# EAGLE design Recording (EAGLE 8.5.0)
AUTHOR: Jared Wolff; BOARD_NUMBER: BRD-0001; COMPANY: Circuit Dojo; DOC_NUMBER: SCH-0001; DOC_REV: 1

## Sheet 1 of 2
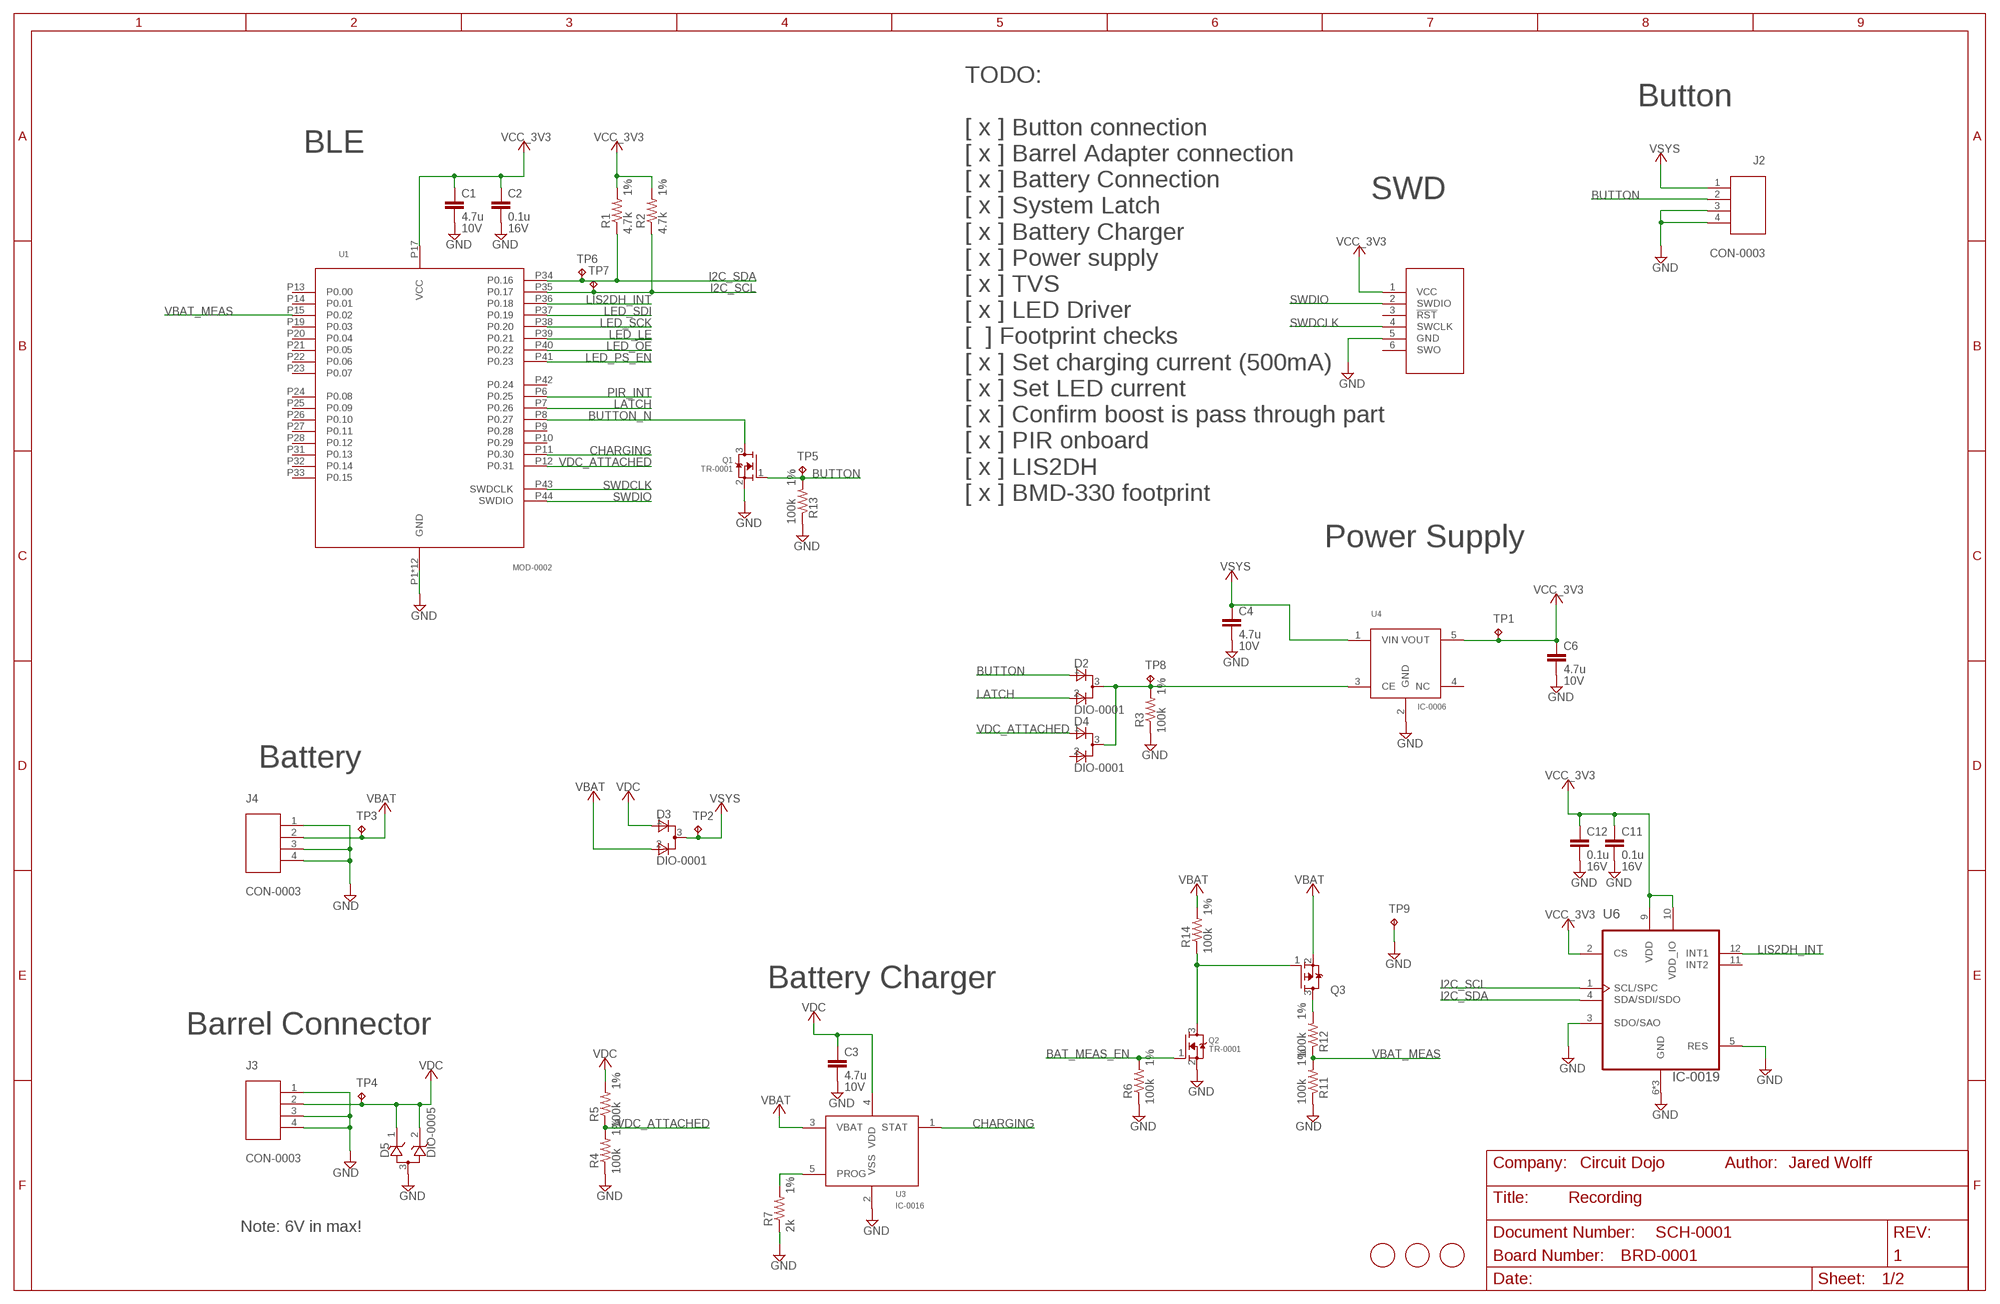
[diagram p0: schematic, sheet 1]

### Parts
C1  4.7u  CAP-0010  [C0603]
C2  0.1u  CAP-0004-SAM  [C0603]
C3  4.7u  CAP-0010  [C0603]
C4  4.7u  CAP-0010  [C0603]
C6  4.7u  CAP-0010  [C0603]
C11  0.1u  CAP-0004-SAM  [C0603]
C12  0.1u  CAP-0004-SAM  [C0603]
D2  DIO-0001  [SOT23]
D3  DIO-0001  [SOT23]
D4  DIO-0001  [SOT23]
D5  DIO-0005  [SOT23]
J1  CON-0002  [TC2030-MCP-NL]
J2  CON-0003  [CON-SM02B-SRSS-TB(LF)(SN)]
J3  CON-0003  [CON-SM02B-SRSS-TB(LF)(SN)]
J4  CON-0003  [CON-SM02B-SRSS-TB(LF)(SN)]
Q1  TR-0001  [SOT23]
Q2  TR-0001  [SOT23]
Q3  TR-0003  [SOT23]
R1  4.7k  RES-0028  [R0603]
R2  4.7k  RES-0028  [R0603]
R3  100k  RES-0001-PAN  [R0603]
R4  100k  RES-0001-PAN  [R0603]
R5  100k  RES-0001-PAN  [R0603]
R6  100k  RES-0001-PAN  [R0603]
R7  2k  RES-0030  [R0603]
R11  100k  RES-0001-PAN  [R0603]
R12  100k  RES-0001-PAN  [R0603]
R13  100k  RES-0001-PAN  [R0603]
R14  100k  RES-0001-PAN  [R0603]
TP1  TP-0001  [TP-1P27]
TP2  TP-0001  [TP-1P27]
TP3  TP-0001  [TP-1P27]
TP4  TP-0001  [TP-1P27]
TP5  TP-0001  [TP-1P27]
TP6  TP-0001  [TP-1P27]
TP7  TP-0001  [TP-1P27]
TP8  TP-0001  [TP-1P27]
TP9  TP-0001  [TP-1P27]
U1  MOD-0002  [MODULE-BMD-300]
U3  IC-0016  [SOT23-5]
U4  IC-0006  [SOT23-5]
U6  IC-0019  [PQFN50P200X200100-12N]
U$1  FIDUCIAL  [FIDUCIAL_1MM]
U$2  FIDUCIAL  [FIDUCIAL_1MM]
U$3  FIDUCIAL  [FIDUCIAL_1MM]

### Nets
BAT_MEAS_EN: Q2.1(G) R6.2
BAT_MEAS_P_GATE: Q2.3(D) Q3.1(G) R14.1
BUTTON: D2.1(A1) J2.2 Q1.1(G) R13.2 TP5.P$1(TP) TP5.P$2(TP) TP5.TP
BUTTON_N: Q1.3(D) U1.P8(P0.27)
CHARGER_PROG: R7.2 U3.5(PROG)
CHARGING: U1.P11(P0.30) U3.1(STAT)
GND: C1.2 C2.2 C3.2 C4.2 C6.2 C11.2 C12.2 D5.3(A) J1.5(GND) J2.3 J2.4 J3.1 J3.3 J3.4 J4.1 J4.3 J4.4 Q1.2(S) Q2.2(S) R3.1 R4.1 R6.1 R7.1 R11.1 R13.1 TP9.P$1(TP) TP9.P$2(TP) TP9.TP U1.P1(GND) U1.P2(GND) U1.P3(GND) U1.P4(GND) U1.P5(GND) U1.P16(GND) U1.P18(GND) U1.P29(GND) U1.P30(GND) U1.P45(GND) U1.P46(GND) U1.P47(GND) U3.2(VSS) U4.2(GND) U6.3(SDO/SAO) U6.5(RES) U6.6(GND) U6.7(GND) U6.8(GND) ; also sheet 2
I2C_SCL: R2.1 TP7.P$1(TP) TP7.P$2(TP) TP7.TP U1.P35(P0.17) U6.1(SCL/SPC)
I2C_SDA: R1.1 TP6.P$1(TP) TP6.P$2(TP) TP6.TP U1.P34(P0.16) U6.4(SDA/SDI/SDO)
LATCH: D2.2(A2) U1.P7(P0.26)
LED_!OE: U1.P40(P0.22) ; also sheet 2
LED_LE: U1.P39(P0.21) ; also sheet 2
LED_PS_EN: U1.P41(P0.23) ; also sheet 2
LED_SCK: U1.P38(P0.20) ; also sheet 2
LED_SDI: U1.P37(P0.19) ; also sheet 2
LIS2DH_INT: U1.P36(P0.18) U6.12(INT1)
N$3: J2.1
PIR_INT: U1.P6(P0.25) ; also sheet 2
SWDCLK: J1.4(SWCLK) U1.P43(SWDCLK)
SWDIO: J1.2(SWDIO) U1.P44(SWDIO)
VBAT: D3.2(A2) J4.2 Q3.2(S) R14.2 TP3.P$1(TP) TP3.P$2(TP) TP3.TP U3.3(VBAT)
VBAT_MEAS: R11.2 R12.1 U1.P15(P0.02)
VBAT_SW: Q3.3(D) R12.2
VCC_3V3: C1.1 C2.1 C6.1 C11.1 C12.1 J1.1(VCC) R1.2 R2.2 TP1.P$1(TP) TP1.P$2(TP) TP1.TP U1.P17(VCC) U4.5(VOUT) U6.2(CS) U6.9(VDD) U6.10(VDD_IO) ; also sheet 2
VCC_3V3_EN: D2.3(C) D4.3(C) R3.2 TP8.P$1(TP) TP8.P$2(TP) TP8.TP U4.3(CE)
VDC: C3.1 D3.1(A1) D5.1(C1) D5.2(C2) J3.2 R5.2 TP4.P$1(TP) TP4.P$2(TP) TP4.TP U3.4(VDD)
VDC_ATTACHED: D4.1(A1) R4.2 R5.1 U1.P12(P0.31)
VSYS: C4.1 D3.3(C) TP2.P$1(TP) TP2.P$2(TP) TP2.TP U4.1(VIN) ; also sheet 2
Unconnected: D4.2(A2) J1.3(!RST) J1.6(SWO) U1.P9(P0.28) U1.P10(P0.29) U1.P13(P0.00) U1.P14(P0.01) U1.P19(P0.03) U1.P20(P0.04) U1.P21(P0.05) U1.P22(P0.06) U1.P23(P0.07) U1.P24(P0.08) U1.P25(P0.09) U1.P26(P0.10) U1.P27(P0.11) U1.P28(P0.12) U1.P31(P0.13) U1.P32(P0.14) U1.P33(P0.15) U1.P42(P0.24) U4.4(NC) U6.11(INT2)

### Notes on the sheet
- Button
- BLE
- SWD
- TODO:
  
  [ x ] Button connection
  [ x ] Barrel Adapter connection
  [ x ] Battery Connection
  [ x ] System Latch
  [ x ] Battery Charger
  [ x ] Power supply
  [ x ] TVS
  [ x ] LED Driver
  [  ] Footprint checks
  [ x ] Set charging current (500mA)
  [ x ] Set LED current
  [ x ] Confirm boost is pass through part
  [ x ] PIR onboard
  [ x ] LIS2DH
  [ x ] BMD-330 footprint
- Power Supply
- Battery
- Battery Charger
- Barrel Connector
- Note: 6V in max!

## Sheet 2 of 2
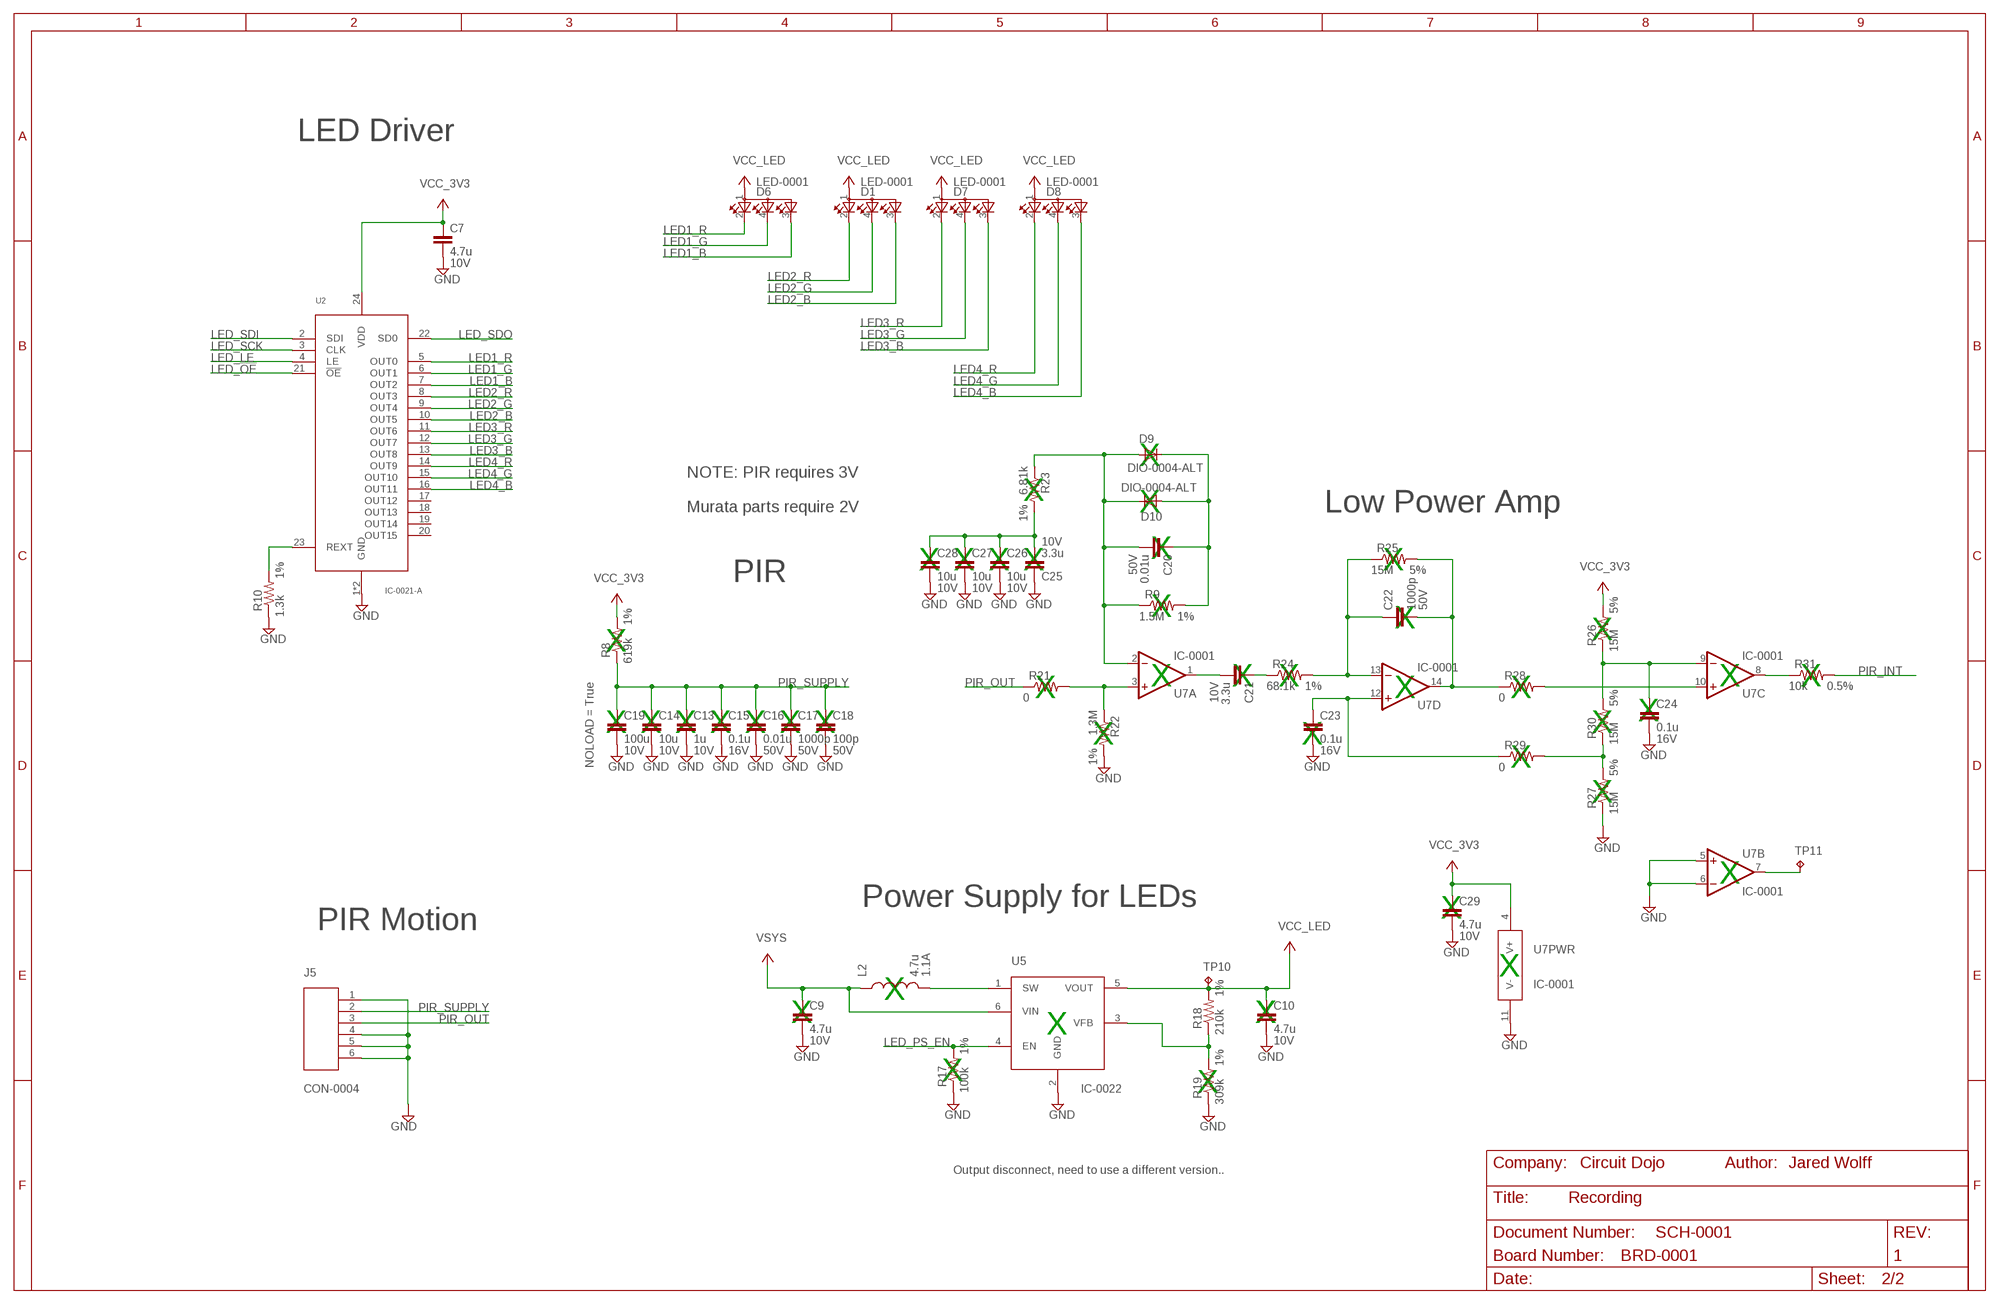
[diagram p1: schematic, sheet 2]

### Parts
C7  4.7u  CAP-0010  [C0603]
C9  4.7u  CAP-0010  [C0603]
C10  4.7u  CAP-0010  [C0603]
C13  1u  CAP-0003-SAM  [C0603]
C14  10u  CAP-0001-YAGEO  [C0805]
C15  0.1u  CAP-0004-SAM  [C0603]
C16  0.01u  CAP-0005  [C0603]
C17  1000p  CAP-0006  [C0603]
C18  100p  CAP-0007-ALT  [C0603]
C19  100u  CAP-0008  [C1210]
C20  0.01u  CAP-0005  [C0603]
C21  3.3u  CAP-0009  [C0603]
C22  1000p  CAP-0006  [C0603]
C23  0.1u  CAP-0004-SAM  [C0603]
C24  0.1u  CAP-0004-SAM  [C0603]
C25  3.3u  CAP-0009  [C0603]
C26  10u  CAP-0001-YAGEO  [C0805]
C27  10u  CAP-0001-YAGEO  [C0805]
C28  10u  CAP-0001-YAGEO  [C0805]
C29  4.7u  CAP-0010  [C0603]
D1  LED-0001  [LED_ASMB-KTF0-0A306]
D6  LED-0001  [LED_ASMB-KTF0-0A306]
D7  LED-0001  [LED_ASMB-KTF0-0A306]
D8  LED-0001  [LED_ASMB-KTF0-0A306]
D9  DIO-0004-ALT  [SOD523]
D10  DIO-0004-ALT  [SOD523]
J5  CON-0004  [CON-SM04B-SRSS-TB(LF)(SN)]
L2  4.7u  IND-0003  [IND-2P0X2P0X1P2]
R8  619k  RES-0018  [R0603]
R9  1.5M  RES-0009  [R0603]
R10  1.3k  RES-0031  [R0603]
R17  100k  RES-0001-PAN  [R0603]
R18  210k  RES-0032  [R0603]
R19  309k  RES-0015-PAN  [R0603]
R21  0  RES-0008  [R0603]
R22  1.3M  RES-0010  [R0603]
R23  6.81k  RES-0014-PAN  [R0603]
R24  68.1k  RES-0013-PAN  [R0603]
R25  15M  RES-0011  [R0603]
R26  15M  RES-0011  [R0603]
R27  15M  RES-0011  [R0603]
R28  0  RES-0008  [R0603]
R29  0  RES-0008  [R0603]
R30  15M  RES-0011  [R0603]
R31  10k  RES-0012-YAGEO  [R0603]
TP10  TP-0001  [TP-1P27]
TP11  TP-0001  [TP-1P27]
U2  IC-0021-A  [SOP65P640X120-25N]
U5  IC-0022  [SOT23-6]
U7  IC-0001  [TSSOP14]

### Nets
BOOST_FB: R18.1 R19.2 U5.3(VFB)
BOOST_SW: L2.P$2 U5.1(SW)
GND: C7.2 C9.2 C10.2 C13.2 C14.2 C15.2 C16.2 C17.2 C18.2 C19.2 C23.2 C24.2 C25.1 C26.2 C27.2 C28.2 C29.2 J5.1 J5.4 J5.5 J5.6 R10.1 R17.1 R19.1 R22.2 R27.1 U2.1(GND) U2.25(GND) U5.2(GND) U7.5(B:+IN) U7.6(B:-IN) U7.11(PWR:V-) ; also sheet 1
LED1_B: D6.3(CGREEN) U2.7(OUT2)
LED1_G: D6.4(CBLUE) U2.6(OUT1)
LED1_R: D6.2(CRED) U2.5(OUT0)
LED2_B: D1.3(CGREEN) U2.10(OUT5)
LED2_G: D1.4(CBLUE) U2.9(OUT4)
LED2_R: D1.2(CRED) U2.8(OUT3)
LED3_B: D7.3(CGREEN) U2.13(OUT8)
LED3_G: D7.4(CBLUE) U2.12(OUT7)
LED3_R: D7.2(CRED) U2.11(OUT6)
LED4_B: D8.3(CGREEN) U2.16(OUT11)
LED4_G: D8.4(CBLUE) U2.15(OUT10)
LED4_R: D8.2(CRED) U2.14(OUT9)
LED_!OE: U2.21(!OE) ; also sheet 1
LED_LE: U2.4(LE) ; also sheet 1
LED_PS_EN: R17.2 U5.4(EN) ; also sheet 1
LED_REXT: R10.2 U2.23(REXT)
LED_SCK: U2.3(CLK) ; also sheet 1
LED_SDI: U2.2(SDI) ; also sheet 1
LED_SDO: U2.22(SD0)
N$4: C20.2 D9.A D10.C R9.1 R23.1 U7.2(A:-IN)
N$5: TP11.P$1(TP) TP11.P$2(TP) TP11.TP U7.7(B:OUT)
N$6: C20.1 D9.C D10.A R9.2
N$8: R21.2 R22.1 U7.3(A:+IN)
N$11: C25.2 C26.1 C27.1 C28.1 R23.2
N$13: C21.2 U7.1(A:OUT)
N$14: C21.1 R24.1
N$15: C22.1 R24.2 R25.1 U7.13(D:-IN)
N$16: C22.2 R25.2 R28.1 U7.14(D:OUT)
N$17: C23.1 R29.1 U7.12(D:+IN)
N$18: R28.2 U7.10(C:+IN)
N$19: R27.2 R29.2 R30.1
N$20: C24.1 R26.1 R30.2 U7.9(C:-IN)
PIR_INT: R31.2 ; also sheet 1
PIR_INT_CL: R31.1 U7.8(C:OUT)
PIR_OUT: J5.3 R21.1
PIR_SUPPLY: C13.1 C14.1 C15.1 C16.1 C17.1 C18.1 C19.1 J5.2 R8.1
VCC_3V3: C7.1 C29.1 R8.2 R26.2 U2.24(VDD) U7.4(PWR:V+) ; also sheet 1
VCC_LED: C10.1 D1.1(A2) D6.1(A2) D7.1(A2) D8.1(A2) R18.2 TP10.P$1(TP) TP10.P$2(TP) TP10.TP U5.5(VOUT)
VSYS: C9.1 L2.P$1 U5.6(VIN) ; also sheet 1
Unconnected: U2.17(OUT12) U2.18(OUT13) U2.19(OUT14) U2.20(OUT15)

### Notes on the sheet
- LED Driver
- X
- X
- NOTE: PIR requires 3V
  
  Murata parts require 2V
- X | Low Power Amp
- X
- X | X | X | X | X
- PIR
- X
- X
- X
- X
- X | X | X | X | X
- X | X | X
- X
- X | X | X | X | X | X | X | X
- X | X
- X
- X
- X
- Power Supply for LEDs
- X
- PIR Motion
- X
- X
- X | X | X
- X
- X
- X
- Output disconnect, need to use a different version..

## Library data of the parts
C1 C3 C4 C6 C7 C9 C10 C29 = wolff-den:CAP-0010: CAP CER 4.7UF 10V X5R 0603; DIGIKEYPN: 1276-6684-1-ND; MPN: CL10A475MP5LNNC; TEMPHIGH: 85; TEMPLOW: -55; VOLTHIGH: 10V
C2 C11 C12 C15 C23 C24 = wolff-den:CAP-0004: CAP CER 0.1UF 16V X7R 0603; DIGIKEYPN: 1276-1005-1-ND; MPN: CL10B104KO8NNNC; TEMPHIGH: 125; TEMPLOW: -55; VOLTHIGH: 16V
C13 = wolff-den:CAP-0003: CAP CER 1UF 10V X5R 0603; DIGIKEYPN: 1276-1182-1-ND; MPN: CL10A105KP8NNNC; TEMPHIGH: 85; TEMPLOW: -55; VOLTHIGH: 10V
C14 C26-C28 = wolff-den:CAP-0001: CAP CER 10UF 10V X5R 0805; DIGIKEYPN: 587-1300-1-ND; MPN: LMK212BJ106KG-T; TEMPHIGH: 85; TEMPLOW: -55; VOLTHIGH: 10V
C16 C20 = wolff-den:CAP-0005: CAP CER 10000PF 50V X7R 0603; DIGIKEYPN: 1276-1921-1-ND; MPN: CL10B103KB8NCNC; TEMPHIGH: 125; TEMPLOW: -55; VOLTHIGH: 50V
C17 C22 = wolff-den:CAP-0006: CAP CER 1000PF 50V X7R 0603; DIGIKEYPN: 1276-1916-1-ND; MPN: CL10B102KB8SFNC; TEMPHIGH: 125; TEMPLOW: -55; VOLTHIGH: 50V
C18 = wolff-den:CAP-0007: CAP CER 100PF 50V C0G/NP0 0603; DIGIKEYPN: 1276-2161-1-ND; MPN: CL10C101GB8NNNC; TEMPHIGH: 125; TEMPLOW: -55; VOLTHIGH: 50V
C19 = wolff-den:CAP-0008: CAP CER 100UF 10V X5R 1210; DIGIKEYPN: 490-9969-1-ND; MPN: GRM32ER61A107ME20L; NOLOAD: True; TEMPHIGH: 85; TEMPLOW: -55; VOLTHIGH: 10V
C21 C25 = wolff-den:CAP-0009: CAP CER 3.3UF 10V X5R 0603; DIGIKEYPN: 1276-1892-1-ND; MPN: CL10A335KP8NNNC; TEMPHIGH: 85; TEMPLOW: -55; VOLTHIGH: 10V
D1 D6-D8 = wolff-den:LED-0001: LED TRI CLR PLCC4 2220 Digi-Key Part Number 516-3906-1-ND Copy Quantity Available 4,754 Can ship immediately Manufacturer Broadcom Limited </en/supplier-centers/b/broadcom> Copy Manufacturer Part Number ASMB-KTF0-0A306 Copy Description LED TRI CLR PLCC4 2220 Copy Lead Free Status / RoHS Status Lead free / RoHS Compliant Moisture Sensitivity Level (MSL) 5A (24 Hours) Manufacturer Standard Lead Time 9 Weeks Detailed Description Red, Green, Blue (RGB) 620nm Red, 524nm Green, 471nm Blue LED Indication - Discrete 2V Red, 2.95V Green, 2.85V Blue 4-PLCC Copy; DIGIKEYPN: 516-3906-1-ND; MPN: ASMB-KTF0-0A306
D2-D4 = wolff-den:DIO-0001: DIODE ARRAY SCHOTTKY 30V SOT23-3; DIGIKEYPN: BAT54CFSCT-ND; MPN: BAT54C; TEMPHIGH: 150; TEMPLOW: -55
D5 = wolff-den:DIO-0005: DIODE ARRAY SCHOTTKY 30V SOT23-3; DIGIKEYPN: SZMMBZ9V1ALT3GOSCT-ND; MPN: SZMMBZ9V1ALT3G; TEMPHIGH: 150; TEMPLOW: -55
D9 D10 = wolff-den:DIO-0004: DIODE GEN PURP 75V 150MA SOD523; DIGIKEYPN: 1N4448XTPMSCT-ND; MPN: 1N4448X-TP
J1 = wolff-den:CON-0002: CONN TAG CONNECT PROG
J2-J4 = wolff-den:CON-0003: CONN HEADER SH 2POS SIDE 1MM TIN Product Overview Digi-Key Part Number 455-1802-2-ND Copy Quantity Available 0 This feature is temporarily unavailable. We are working diligently to get this fixed. Thank you for your patience. Manufacturer JST Sales America Inc. </en/supplier-centers/j/jst> Copy Manufacturer Part Number SM02B-SRSS-TB(LF)(SN) Copy Description CONN HEADER SH 2POS SIDE 1MM TIN Copy Lead Free Status / RoHS Status Lead free / RoHS Compliant Moisture Sensitivity Level (MSL) 1 (Unlimited) Manufacturer Standard Lead Time 24 Weeks Detailed Description Connector Header Surface Mount, Right Angle 2 position 0.039" (1.00mm) Copy; DIGIKEYPN: 455-1802-2-ND; MPN: SM02B-SRSS-TB(LF)(SN)
J5 = wolff-den:CON-0004: CONN HEADER SH 4POS SIDE 1MM TIN Product Overview Digi-Key Part Number 455-1804-1-ND Copy Quantity Available 14,510 Can ship immediately Manufacturer JST Sales America Inc. </en/supplier-centers/j/jst> Copy Manufacturer Part Number SM04B-SRSS-TB(LF)(SN) Copy Description CONN HEADER SH 4POS SIDE 1MM TIN Copy Lead Free Status / RoHS Status Lead free / RoHS Compliant Moisture Sensitivity Level (MSL) 1 (Unlimited) Manufacturer Standard Lead Time 24 Weeks Detailed Description Connector Header Surface Mount, Right Angle 4 position 0.039" (1.00mm) Copy; DIGIKEYPN: 296-47855-1-ND; MPN: 296-47855-1-ND
L2 = wolff-den:IND-0003: FIXED IND 4.7UH 750MA 390 MOHM; CURRENT: 1.1A; DIGIKEYPN: 587-4705-1-ND; MPN: NRV2012T4R7MGF
Q1 Q2 = wolff-den:TR-0001: MOSFET N-CH 60V 360MA TO-236AB; DIGIKEYPN: 1727-1142-1-ND; MPN: BSS138P,215; TEMPHIGH: 150; TEMPLOW: -55
Q3 = wolff-den:TR-0003: MOSFET P-CH 50V 130MA SOT23-3; DIGIKEYPN: BSS84-FDICT-ND; MPN: BSS84-7-F; TEMPHIGH: 150; TEMPLOW: -55
R1 R2 = wolff-den:RES-0028: RES SMD 4.7K OHM 1% 1/10W 0603; DIGIKEYPN: RMCF0603FT4K70CT-ND; MPN: RMCF0603FT4K70; TEMPHIGH: 155; TEMPLOW: -55; TOLERANCE: 1%
R3-R6 R11-R14 R17 = wolff-den:RES-0001: RES SMD 100K OHM 1% 1/10W 0603; DIGIKEYPN: P100KHCT-ND; MPN: ERJ-3EKF1003V; TEMPHIGH: 155; TEMPLOW: -55; TOLERANCE: 1%
R7 = wolff-den:RES-0030: RES SMD 2K OHM 1% 1/10W 0603; DIGIKEYPN: RNCP0603FTD2K00CT-ND; MPN: RNCP0603FTD2K00; TEMPHIGH: 155; TEMPLOW: -55; TOLERANCE: 1%
R8 = wolff-den:RES-0018: RES SMD 619k OHM 1% 1/10W 0603; DIGIKEYPN: 311-619KHRCT-ND; MPN: RC0603FR-07619KL; TEMPHIGH: 155; TEMPLOW: -55; TOLERANCE: 1%
R9 = wolff-den:RES-0009: RES SMD 1.5M OHM 1% 1/10W 0603; DIGIKEYPN: 311-1.50MHRCT-ND; MPN: RC0603FR-071M5L; TEMPHIGH: 155; TEMPLOW: -55; TOLERANCE: 1%
R10 = wolff-den:RES-0031: RES SMD 1.3K OHM 1% 1/10W 0603; DIGIKEYPN: RMCF0603FT1K30CT-ND; MPN: RMCF0603FT1K30; TEMPHIGH: 155; TEMPLOW: -55; TOLERANCE: 1%
R18 = wolff-den:RES-0032: RES SMD 210K OHM 1% 1/10W 0603; DIGIKEYPN: YAG2501CT-ND; MPN: RC0201FR-07210KL; TEMPHIGH: 155; TEMPLOW: -55; TOLERANCE: 1%
R19 = wolff-den:RES-0015: RES SMD 309K OHM 1% 1/10W 0603; DIGIKEYPN: P309KHTR-ND; MPN: ERJ-3EKF3093V; TEMPHIGH: 155; TEMPLOW: -55; TOLERANCE: 1%
R21 R28 R29 = wolff-den:RES-0008: RES SMD 0 OHM JUMPER 1/10W 0603; DIGIKEYPN: 311-0.0GRCT-ND; MPN: RC0603JR-070RL; TEMPHIGH: 155; TEMPLOW: -55
R22 = wolff-den:RES-0010: RES SMD 1.3M OHM 1% 1/10W 0603; DIGIKEYPN: YAG3326CT-ND; MPN: RC0603FR-071M3L; TEMPHIGH: 155; TEMPLOW: -55; TOLERANCE: 1%
R23 = wolff-den:RES-0014: RES SMD 6.81K OHM 1% 1/10W 0603; DIGIKEYPN: P6.81KHCT-ND; MPN: ERJ-3EKF6811V; TEMPHIGH: 155; TEMPLOW: -55; TOLERANCE: 1%
R24 = wolff-den:RES-0013: RES SMD 68.1K OHM 1% 1/10W 0603; DIGIKEYPN: P68.1KHTR-ND; MPN: ERJ-3EKF6812V; TEMPHIGH: 155; TEMPLOW: -55; TOLERANCE: 1%
R25-R27 R30 = wolff-den:RES-0011: RES SMD 15M OHM 5% 1/10W 0603; DIGIKEYPN: RMCF0603JT15M0CT-ND; MPN: RMCF0603JT15M0; TEMPHIGH: 155; TEMPLOW: -55; TOLERANCE: 5%
R31 = wolff-den:RES-0012: RES SMD 10K OHM 1% 1/10W 0603; DIGIKEYPN: YAG2318CT-ND; MPN: RT0603DRE0710KL; TEMPHIGH: 155; TEMPLOW: -55; TOLERANCE: 0.5%
TP1-TP11 = wolff-den:TP-0001: TEST POINT
U1 = wolff-den:MOD-0002: MOD BLE 5 NORDIC NRF52810 SOC; DIGIKEYPN: 1604-1024-1-ND; MPN: BMD-330-A-R; TEMPHIGH: 85; TEMPLOW: 40; VOLTHIGH: 3.6; VOLTLOW: 1.7
U2 = wolff-den:IC-0021: IC LED DRVR LIN DIM 90MA 24TSSOP; DIGIKEYPN: TC62D722CFNGCELCT-ND; MPN: TC62D722CFNG,C,EL; VOLTHIGH: 5.5; VOLTLOW: 3
U3 = wolff-den:IC-0016: IC CONTROLLR LI-ION 4.2V SOT23-5; DIGIKEYPN: MCP73831T-2ACI/OTTR-ND; MPN: MCP73831T-2ACI/OT; VOLTHIGH: 6; VOLTLOW: 3.75
U4 = wolff-den:IC-0006: IC REG LINEAR 3.3V 250MA SOT23-5; DIGIKEYPN: AP2139AK-3.3TRG1DICT-ND; MPN: AP2139AK-3.3TRG1; TEMPHIGH: 85; TEMPLOW: -40; VOLTHIGH: 5.5; VOLTLOW: 3.3
U5 = wolff-den:IC-0022: IC REG BST ADJ 0.75A SYNC TSOT23; DIGIKEYPN: 863-1495-2-ND; MPN: AAT1217ICA-1.2-T1; TEMPHIGH: 85; TEMPLOW: -40; VOLTHIGH: 5.5; VOLTLOW: 0.5
U6 = wolff-den:IC-0019: ACCEL 2-16G I2C/SPI 12LGA; AVAILABILITY: Good; DESCRIPTION: MEMS digital output motion sensor: ultra low-power high performance 3-axes femto accelerometer; DIGIKEYPN: 497-14851-1-ND; MF: STMicroelectronics; MPN: LIS2DH12TR; PACKAGE: LGA-12 STMicroelectronics; PRICE: 0.85 USD; VOLTHIGH: 3.6; VOLTLOW: 1.71
U7 = wolff-den:IC-0001: IC OP AMP RR 5KHZ 14TSSOP; DIGIKEYPN: 296-47855-1-ND; MOUSERPN: 595-TLV8544PWR; MPN: TLV8544PWR; TEMPHIGH: 125; TEMPLOW: -40; VOLTHIGH: 3.6; VOLTLOW: 1.7
U$1-U$3 = adafruit:FIDUCIAL: For use by pick and place machines to calibrate the vision/machine, 1mm By microbuilder.eu

## Board
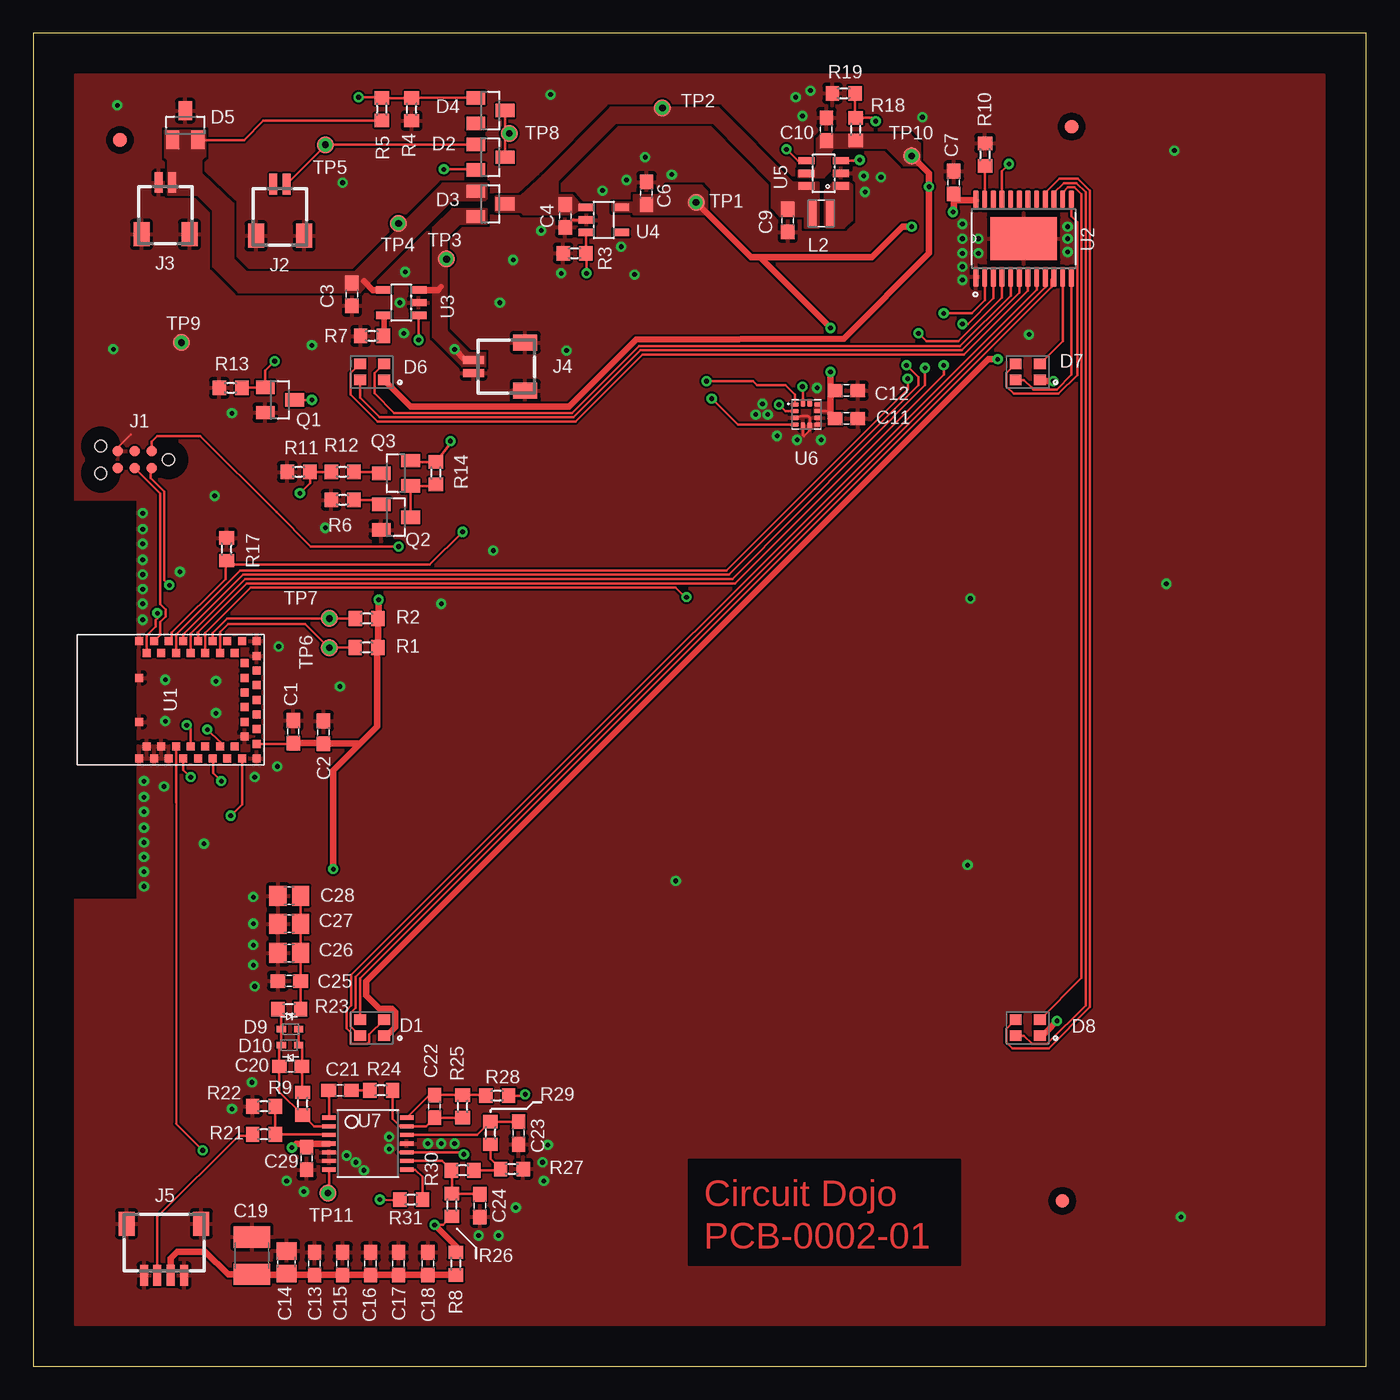
[diagram p2: board, top side]
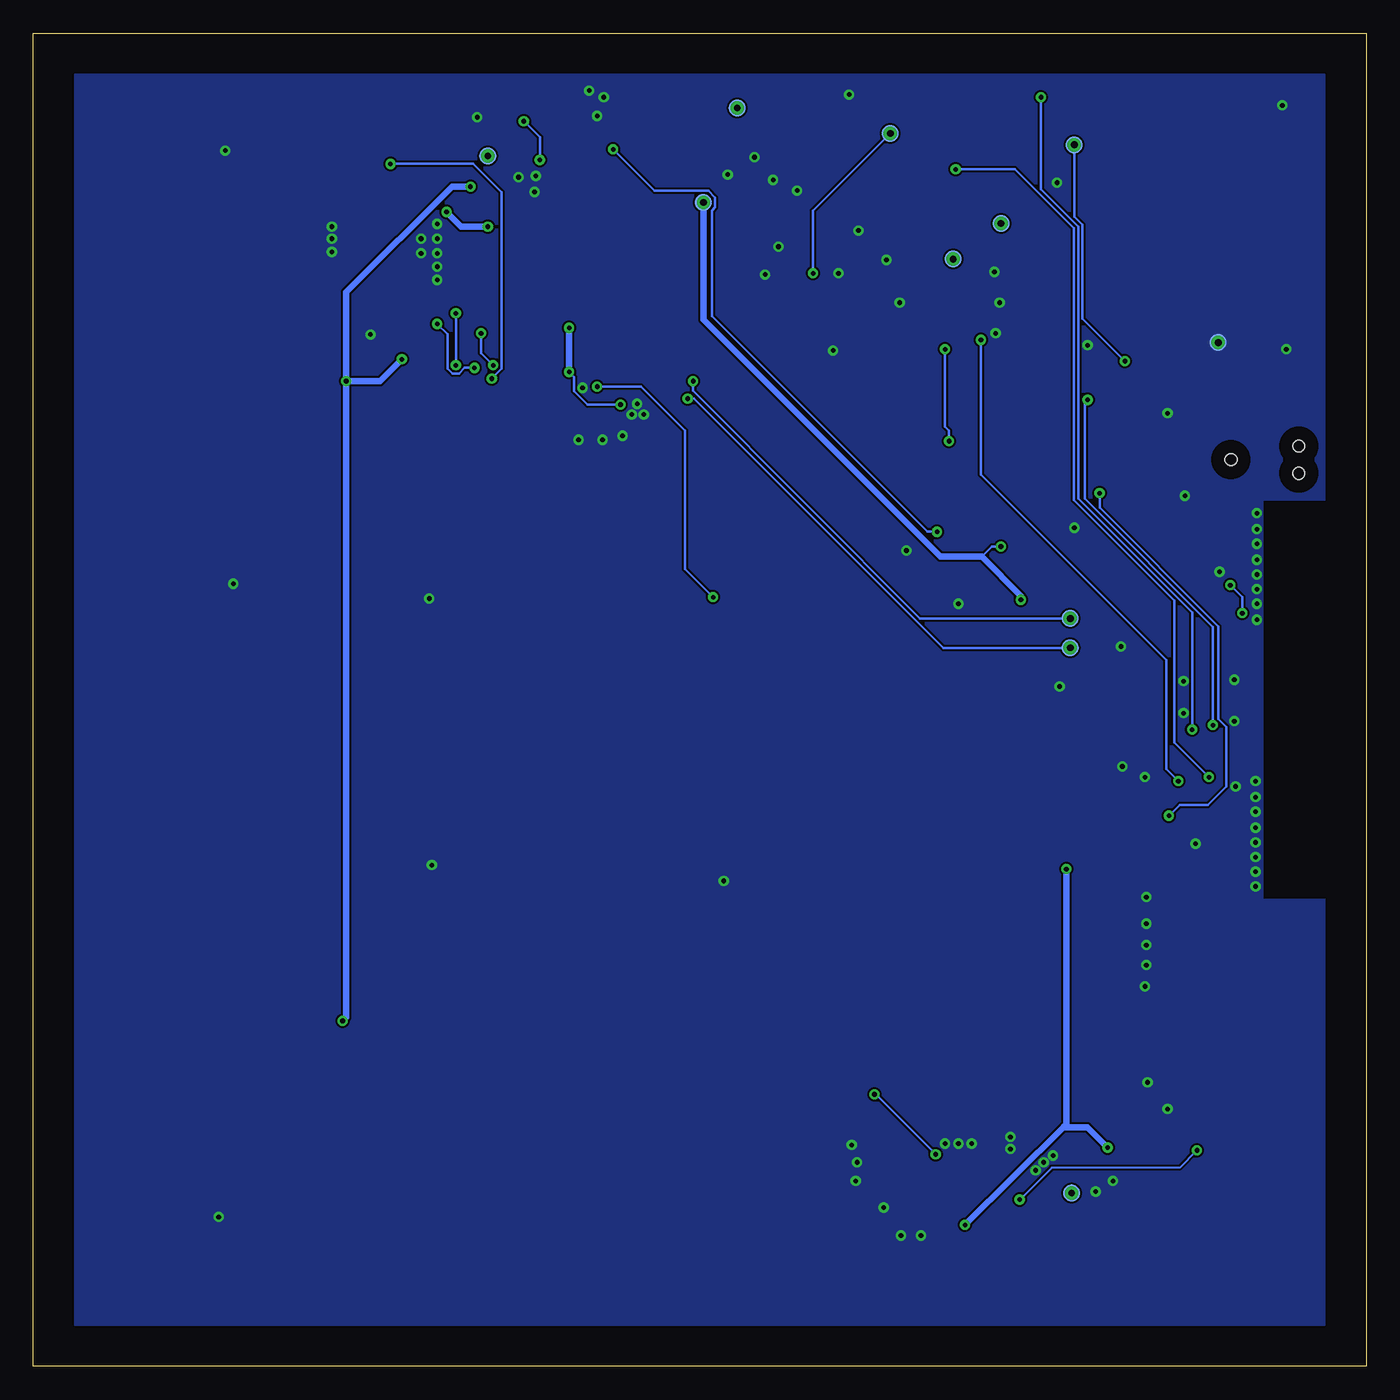
[diagram p3: board, bottom side, seen from below]

Size 100 x 100 mm. Coordinates in mm from the lower left corner, seen from the top.
Outline: 0,0 100,0 100,100 0,100 0,0
Copper layers (1*16): Top 0.035mm / dielectric 1.5mm / Bottom 0.035mm
Design rules "default *": minimum track width 6mil, minimum drill 0.35mm, track to track 6mil, track to pad 6mil, pad to pad 6mil, via to via 6mil, smd to smd 6mil, copper to edge 40mil, drill to drill 6mil, minimum pad ring 10mil, minimum via ring 8mil, stop-mask expansion 4mil, vias tented up to drill 0.35mm, thermal gap 10mil
tKeepout: area 35,25 to 65,67
tRestrict: 4 lines

### Footprints (pad centres in the part's own frame; a part is rotated, then mirrored left to right if it is on the bottom)
C0603 = smd 1.1 x 1: 1 -0.85,0; 2 0.85,0
C0805 = smd 1.3 x 1.5: 1 -0.85,0; 2 0.85,0
C1210 = smd 1.6 x 2.7: 1 -1.4,0; 2 1.4,0
LED_ASMB-KTF0-0A306 = smd 0.9 x 0.8: 1 0.9,-0.6; 2 0.9,0.6; 3 -0.9,0.6; 4 -0.9,-0.6
SOT23 = smd 1 x 1.4: 1 -0.95,-1.1; 2 0.95,-1.1; 3 0,1.1
SOD523 = smd 0.7 x 0.5: A 0.7,0; C -0.6,0
TC2030-MCP-NL = smd 0.787 x 0.787: 1 1.27,-0.635; 2 1.27,0.635; 3 2.54,-0.635; 4 2.54,0.635; 5 3.81,-0.635; 6 3.81,0.635 | hole 0.889: 0,0; 5.08,-1.016; 5.08,1.016
CON-SM02B-SRSS-TB(LF)(SN) = smd 0.6 x 1.55: 1 -0.5,1.975; 2 0.5,1.975 | smd 1.2 x 1.8: 3 -1.8,-1.9; 4 1.8,-1.9
CON-SM04B-SRSS-TB(LF)(SN) = smd 0.6 x 1.55: 1 -1.5,1.975; 2 -0.5,1.975; 3 0.5,1.975; 4 1.5,1.975 | smd 1.2 x 1.8: 5 -2.8,-1.9; 6 2.8,-1.9
IND-2P0X2P0X1P2 = smd 0.65 x 2: P$1 -0.675,0; P$2 0.675,0
R0603 = smd 1 x 1.1: 1 -0.85,0; 2 0.85,0
TP-1P27 = drill 0.5: P$1 0,0 | smd 1.27 x 1.27 bottom: P$2 0,0 | smd 1.27 x 1.27: TP 0,0
MODULE-BMD-300 = smd 0.6 x 0.6: P1 -4.4,4.35; P2 -3.5,3.8; P3 -4.4,3.25; P4 -3.5,2.7; P5 -4.4,2.15; P6 -3.5,1.6; P7 -4.4,1.05; P8 -3.5,0.5; P9 -4.4,-0.05; P10 -3.5,-0.6; P11 -4.4,-1.15; P12 -3.5,-1.7; P13 -4.4,-2.25; P14 -3.5,-2.8; P15 -4.4,-3.35; P16 -4.4,-4.45; P17 -3.3,-4.45; P18 -2.75,-3.55; P19 -2.2,-4.45; P20 -1.65,-3.55; P21 -1.1,-4.45; P22 -0.55,-3.55; P23 0,-4.45; P24 0.55,-3.55; P25 1.1,-4.45; P26 1.65,-3.55; P27 2.2,-4.45; P28 2.75,-3.55; P29 3.3,-4.45; P30 4.4,-4.45; P31 4.4,-3.35; P32 3.5,-2.8; P33 4.4,-2.25; P34 3.5,-1.7; P35 4.4,-1.15; P36 3.5,-0.6; P37 4.4,-0.05; P38 3.5,0.5; P39 4.4,1.05; P40 3.5,1.6; P41 4.4,2.15; P42 3.5,2.7; P43 4.4,3.25; P44 3.5,3.8; P45 4.4,4.35; P46 1.65,4.35; P47 -1.65,4.35
SOP65P640X120-25N = smd 1.49 x 0.41: 1 -2.87,3.575; 2 -2.87,2.925; 3 -2.87,2.275; 4 -2.87,1.625; 5 -2.87,0.975; 6 -2.87,0.325; 7 -2.87,-0.325; 8 -2.87,-0.975; 9 -2.87,-1.625; 10 -2.87,-2.275; 11 -2.87,-2.925; 12 -2.87,-3.575; 13 2.87,-3.575; 14 2.87,-2.925; 15 2.87,-2.275; 16 2.87,-1.625; 17 2.87,-0.975; 18 2.87,-0.325; 19 2.87,0.325; 20 2.87,0.975; 21 2.87,1.625; 22 2.87,2.275; 23 2.87,2.925; 24 2.87,3.575 | smd 3.2 x 5: 25 0,0
SOT23-5 = smd 0.55 x 1.2: 1 -0.95,-1.3; 2 0,-1.3; 3 0.95,-1.3; 4 0.95,1.3; 5 -0.95,1.3
SOT23-6 = smd 0.55 x 1.2: 1 -0.95,-1.3; 2 0,-1.3; 3 0.95,-1.3; 4 0.95,1.3; 5 0,1.3; 6 -0.95,1.3
PQFN50P200X200100-12N = smd 0.575 x 0.35: 1 -0.875,0.75; 2 -0.875,0.25; 3 -0.875,-0.25; 4 -0.875,-0.75; 7 0.875,-0.75; 8 0.875,-0.25; 9 0.875,0.25; 10 0.875,0.75 | smd 0.35 x 0.575: 5 -0.25,-0.875; 6 0.25,-0.875; 11 0.25,0.875; 12 -0.25,0.875
TSSOP14 = smd 0.305 x 0.991: 1 -1.95,-2.918; 2 -1.3,-2.918; 3 -0.65,-2.918; 4 0,-2.918; 5 0.65,-2.918; 6 1.3,-2.918; 7 1.95,-2.918; 8 1.95,2.918; 9 1.3,2.918; 10 0.65,2.918; 11 0,2.918; 12 -0.65,2.918; 13 -1.3,2.918; 14 -1.95,2.918
FIDUCIAL_1MM = smd 1 x 1: 1 0,0

### Placement (x,y rotation side)
C1  19.5,47.6 90 top
C2  21.77,47.56 90 top
C3  23.9,80.4 270 top
C4  39.9,86.3 270 top
C6  46,88 90 top
C7  69.06,88.8 90 top
C9  56.6,85.95 270 top
C10  59.5,92.8 90 top
C11  61,71.1 0 top
C12  61,73.2 0 top
C13  21.1,7.7 90 top
C14  19,7.8 90 top
C15  23.2,7.7 90 top
C16  25.3,7.7 90 top
C17  27.4,7.7 90 top
C18  29.6,7.7 90 top
C19  16.4,8.3 90 top
C20  19.3,22.5 180 top
C21  23,20.7 180 top
C22  30.1,19.5 90 top
C23  36.4,17.5 270 top
C24  33.5,12.05 270 top
C25  19.2,28.9 0 top
C26  19.2,31 180 top
C27  19.2,33.2 180 top
C28  19.2,35.3 180 top
C29  20.5,15.6 270 top
D1  25.4,25.4 0 top
D2  34.3,90.7 270 top
D3  34.3,87.2 270 top
D4  34.3,94.2 270 top
D5  11.4,93.1 0 top
D6  25.4,74.6 0 top
D7  74.6,74.6 0 top
D8  74.6,25.4 0 top
D9  19.3,25.3 180 top
D10  19.2,24.1 0 top
J1  10.14,68.01 180 top
J2  18.5,86.7 0 top
J3  9.92,86.83 0 top
J4  35,75 90 top
J5  9.8,8.8 180 top
L2  59.1,86.5 0 top
Q1  18.5,72.5 270 top
Q2  27.2,63.7 270 top
Q3  27.2,67 90 top
R1  24.99,53.92 0 top
R2  25,56.1 0 top
R3  40.6,83.5 0 top
R4  28.38,94.29 90 top
R5  26.14,94.31 270 top
R6  23.2,65 0 top
R7  25.4,77.3 0 top
R8  31.7,7.7 90 top
R9  20.2,19.7 90 top
R10  71.4,90.9 270 top
R11  19.9,67.1 0 top
R12  23.2,67.1 0 top
R13  14.8,73.4 0 top
R14  30.2,67 90 top
R17  14.5,61.3 270 top
R18  61.7,92.8 270 top
R19  60.8,95.5 0 top
R21  17.3,17.4 0 top
R22  17.3,19.5 180 top
R23  19.2,26.8 0 top
R24  26.1,20.7 0 top
R25  32.2,19.5 90 top
R26  31.4,12.1 270 top
R27  35.9,14.8 180 top
R28  34.8,20.3 0 top
R29  34.3,17.5 270 top
R30  32.2,14.7 180 top
R31  28.35,12.5 180 top
TP1  49.72,87.32 180 top
TP2  47.2,94.4 180 top
TP3  31,83.06 0 top
TP4  27.4,85.74 180 top
TP5  21.9,91.64 180 top
TP6  22.2,53.9 0 top
TP7  22.2,56.1 0 top
TP8  35.7,92.5 180 top
TP9  11.1,76.8 0 top
TP10  65.9,90.8 0 top
TP11  22.1,13 0 top
U1  12.3,50 90 top
U2  74.3,84.6 90 top
U3  27.6,79.8 90 top
U4  42.8,86 270 top
U5  59.3,89.5 90 top
U6  58,71.4 0 top
U7  25.1,16.7 270 top
U$1  77.2,12.4 0 top
U$2  6.5,92 0 top
U$3  77.9,93 0 top

### Tracks (layer width: path | path; a pad name or v marks a point on that pad's centre or on a via)
BAT_MEAS_EN
  Top 0.17: Q2.1 25.75,65 R6.2
BAT_MEAS_P_GATE
  Top 0.17: Q2.3 Q3.1 30.1,66.05 R14.1
BOOST_FB  (via drill 0.35)
  Top 0.17: R19.2 61.65,93.7 R18.1 62.95,93.65 v63.2,93.4 | U5.3 61.95,90.45 v62,90.5
  Bottom 0.17: v63.2,93.4 62,92.2 v62,90.5
BOOST_SW
  pour Top (no thermals): 59.4,87.5 59.4,85.5 59.5,85.4 60.8,85.4 61.4,86 61.4,88.6 61.2,88.8 60,88.8 59.5,88.3 59.4,88.2
BUTTON  (via drill 0.35)
  Top 0.17: J2.2 21.98,91.65 | 21.98,91.65 D2.1 | R13.2 17.35,73.4 Q1.1 17.4,74.7 v18.1,75.4 | TP5.P$2 21.98,91.65
  Bottom 0.17: v18.1,75.4 21.28,78.58 21.28,85.63 21.9,86.26 TP5.P$2
BUTTON_N  (via drill 0.35)
  Top 0.17: v11.5,48.1 11.8,47.8 U1.P8 | v20.9,72.5 Q1.3
  Bottom 0.17: v11.5,48.1 11.5,55.46 21.12,65.08 21.12,72.28 v20.9,72.5
CHARGER_PROG
  Top 0.4: R7.2 26.3,76.95 U3.5
CHARGING  (via drill 0.35)
  Top 0.17: U3.1 v28.9,77 | U1.P11 13.5,45.55 13.5,44.5 v14.1,43.9
  Bottom 0.17: v28.9,77 28.9,66.9 15,53 15,44.8 v14.1,43.9
GND  (via drill 0.35)
  Top 0.17: J1.5 6.33,68.93 7.3,69.9 | U6.3 57.21,71.24 57.48,71.24 57.54,71.3 58.1,71.3 58.25,71.15 U6.6 58.25,70.25 57.8,69.8 57.75,69.85 U6.5
  Top 0.2: C4.2 40.45,86 41.1,86
  other vias: 44.5,89 45.9,90.7 39.6,82 36,83 45.1,81.9 44.1,84 47.9,89.4 27.9,82.1 27.8,77.5 27.5,79.8 13.7,51.4 13.7,49 9.9,51.5 9.9,48.4 23,51 18.4,54 11,59.6 13.6,65.3 9.8,43.5 18.3,45 16.6,44.2 70.3,57.6 70.1,37.6 48.2,36.4 55.8,69.8 57.3,69.5 59.1,69.5 58.8,73.4 8.2,58.3 8.2,59.4 8.2,60.5 8.2,61.7 8.2,62.8 8.2,64 12.8,39.2 36.2,11.9 86.1,11.2 85,58.7 85.6,91.2 66.7,93.7 38.8,95.4 6.3,94.6 6,76.3 23.2,88.8 20.9,76.6 35,79.8 40,76.2 14.9,71.5 8.3,36 8.3,37.1 8.3,38.2 8.3,39.3 8.3,40.4 8.3,41.6 8.3,42.7 8.3,43.9 55.1,71.4 8.2,57.2 8.2,56 42.7,88.2 38.1,85.2 29.6,16.7 30.6,16.7 31.6,16.7 26.7,17.2 26.7,16.3 23.5,15.8 34.9,9.8 33.4,9.8 38.3,13.9 38.2,15.3 38.6,16.6 19,13.9 20.3,13.1 14.9,19.3 16.4,21.3 16.6,28.5 16.5,30.1 16.5,31.6 16.5,33.2 16.5,35.2 62.3,89.3 62.4,88.1 63.6,89.2 58.3,95.7 57.7,93.8 57.2,95.2 70.9,84.6 70.9,83.5 69.7,85.7 69.7,84.6 69.7,83.5 77.6,85.5 77.6,84.6 77.6,83.6 69.7,82.5 69.7,81.5 74.7,77.4 21.9,62.9 30.6,57.2 34.5,61.2 24.8,14.7 24.2,15.3 54.2,71.4 54.7,72.2
  pour Top (rank 2): 3.17,3.17 96.83,3.17 96.83,96.83 3.17,96.83
  pour Bottom (rank 2): 96.83,3.17 3.17,3.17 3.17,96.83 96.83,96.83
I2C_SCL  (via drill 0.35)
  Top 0.17: R2.1 TP7.P$2 14.54,56.1 13.45,55.01 U1.P35 | 57.08,72.1 U6.1 57.12,72.9 56.42,73.6 54.3,73.6 54,73.9 v50.5,73.9
  Bottom 0.17: TP7.P$2 33.47,56.1 50.5,73.2 v50.5,73.9
I2C_SDA  (via drill 0.35)
  Top 0.17: R1.1 22.22,53.92 TP6.P$2 20.4,55.7 14.6,55.7 14,55.1 U1.P34 | U6.4 52.85,70.65 v50.9,72.6
  Bottom 0.17: TP6.P$2 31.73,53.9 50.43,72.6 v50.9,72.6
LATCH  (via drill 0.35)
  Top 0.17: v11.8,44.2 11.25,44.75 U1.P7 | v30.8,89.8 33.15,89.8 D2.2
  Bottom 0.17: v11.8,44.2 14.4,46.8 14.4,57.44 21.92,64.97 21.92,85.37 26.36,89.8 v30.8,89.8
LED1_B
  Top 0.17: U2.7 74.6,81.7 74.6,80.7 69.8,75.9 45.7,75.9 40.67,70.87 25.83,70.87 23.81,72.89 23.81,74.5 24.5,75.19 D6.3
LED1_G
  Top 0.17: U2.6 73.97,80.53 69.67,76.22 45.57,76.22 40.53,71.19 25.97,71.19 24.5,72.66 D6.4
LED1_R
  Top 0.17: D6.2 26.3,75.19 25.61,74.5 25.61,73.01 25.6,73 27.09,71.51 40.4,71.51 45.43,76.55 69.53,76.55 73.33,80.34 U2.5
LED2_B
  Top 0.17: U2.10 76.37,81.52 76.37,80.95 24.5,29.08 D1.3
LED2_G
  Top 0.17: D1.4 23.81,25.49 23.81,26.5 24.18,26.86 24.18,29.21 75.92,80.96 U2.9
LED2_R
  Top 0.17: D1.2 25.19,24.89 25.19,24.3 25.05,24.16 23.95,24.16 23.91,24.2 23.8,24.2 23.8,25.04 23.49,25.35 23.49,26.69 23.86,27.05 23.86,29.35 75.28,80.77 U2.8
LED3_B
  Top 0.17: D7.3 73.7,75.19 73.01,74.5 73.01,73.5 73.55,72.96 76.91,72.96 78.32,74.36 78.32,85.83 77.88,86.27 U2.13
LED3_G
  Top 0.17: D7.4 74.31,74 74.91,73.41 74.95,73.36 75.03,73.28 76.78,73.28 77.88,74.38 U2.12
LED3_R
  Top 0.17: U2.11 77.22,76.92 D7.2
LED4_B
  Top 0.17: D8.3 73.7,25.99 73.01,25.3 73.01,24.3 73.47,23.84 76.18,23.84 79.28,26.94 79.28,88.2 78.39,89.1 76.98,89.1 75.92,88.05 U2.16
LED4_G
  Top 0.17: D8.4 74.31,24.8 74.95,24.16 76.05,24.16 78.96,27.08 78.96,88.06 78.25,88.78 77.3,88.78 76.58,88.05 U2.15
LED4_R
  Top 0.17: D8.2 78.64,29.14 78.64,87.93 78.12,88.45 77.63,88.45 77.22,88.05 U2.14
LED_!OE  (via drill 0.35)
  Top 0.17: U1.P40 10.71,53.51 10.71,54.9 15.51,59.7 15.52,59.7 51.9,59.7 52,59.7 65.6,73.3 v65.6,74.1 | v73.2,90.2 72.67,89.67 U2.21
  Bottom 0.17: v65.6,74.1 65.6,74.13 64.88,74.84 64.88,88.08 67,90.2 v73.2,90.2
LED_LE  (via drill 0.35)
  Top 0.17: U1.P39 11.25,54.88 15.75,59.38 52.18,59.38 66.4,73.6 66.4,74.2 v65.5,75.1 | U2.4 72.67,80.17 69.4,76.9 67,76.9 v66.4,77.5
  Bottom 0.17: v66.4,77.5 66.4,76 v65.5,75.1
LED_PS_EN  (via drill 0.35)
  Top 0.17: U5.4 57.35,90.45 v56.5,91.3 | v32.2,62.6 29.73,60.13 14.82,60.13 R17.2 14.43,60.38 14.43,59.07 10.39,55.03 10.39,54.64 U1.P41 10.24,54.49
  Bottom 0.17: v56.5,91.3 53.39,88.19 49.36,88.19 48.85,87.68 48.85,86.96 49.1,86.71 49.1,78.8 32.93,62.63 32.23,62.63 v32.2,62.6
LED_REXT
  Top 0.17: U2.23 71.38,90.12 R10.2
LED_SCK  (via drill 0.35)
  Top 0.17: U1.P38 11.81,53.51 11.81,54.99 15.88,59.05 52.47,59.05 66.9,73.59 v66.9,74.9 | U2.3 72.03,80.12 70.1,78.2 v69.7,78.2
  Bottom 0.17: v69.7,78.2 68.92,77.42 68.92,74.84 68.56,74.48 68.05,74.48 67.63,74.9 v66.9,74.9
LED_SDI  (via drill 0.35)
  Top 0.17: U1.P37 12.35,55.05 12.34,55.06 16.02,58.73 16.1,58.73 52.63,58.73 68.3,74.4 v68.3,75.1 | U2.2 71.38,79.97 70.4,79 v68.3,79
  Bottom 0.17: v68.3,79 v68.3,75.1
LIS2DH_INT  (via drill 0.35)
  Top 0.17: U1.P36 12.9,55 16.31,58.41 48.19,58.41 48.9,57.7 v49,57.7 | U6.12 57.75,73.45 v57.7,73.5
  Bottom 0.17: v49,57.7 51.1,59.8 51.1,70.2 54.4,73.5 55.2,73.5 55.3,73.5 v57.7,73.5
N$4
  Top 0.17: U7.2 21.05,18 R9.1 18.45,20.6 C20.2 18.45,23.95 D10.C D9.A 18.6,26.55 R23.1
N$5
  Top 0.17: U7.7 22.18,13.08 TP11.TP
N$6
  Top 0.17: R9.2 20.15,20.6 C20.1 20.15,23.85 D10.A D9.C
N$8
  Top 0.17: U7.3 22.13,17.4 R21.2 R22.1
N$11
  Top 0.17: R23.2 C25.2 C26.1 C27.1 C28.1
N$13
  Top 0.17: U7.1 22.18,20.67 C21.2
N$14
  Top 0.17: C21.1 R24.1
N$15
  Top 0.17: R25.1 C22.1 29.45,18 U7.13 27.5,18 26.95,18.55 R24.2
N$16
  Top 0.17: U7.14 29.72,20.35 C22.2 30.1,20.4 30.15,20.35 R25.2 33.9,20.35 R28.1
N$17
  Top 0.17: U7.12 33.3,17.35 R29.1 C23.1
N$18  (via drill 0.35)
  Top 0.17: 27.35,16.05 U7.10 32.25,16.05 32.3,16.1 v32.3,15.9 | R28.2 36.8,20.3 v36.9,20.4
  Bottom 0.17: v32.3,15.9 36.8,20.4 v36.9,20.4
N$19
  Top 0.17: R30.1 34.65,14.7 R27.2 34.3,15.55 R29.2
N$20
  Top 0.17: U7.9 30.65,15.4 R30.2 31.4,14.65 R26.1 33.45,12.95 C24.1
PIR_INT  (via drill 0.35)
  Top 0.152: 10.7,42.3 10.7,18.2 v12.7,16.2 | v26,12.5 R31.2
  Top 0.17: U1.P6 10.7,42.3
  Bottom 0.152: v12.7,16.2 14,14.9 23.6,14.9 v26,12.5
PIR_INT_CL
  Top 0.17: U7.8 28.65,14.75 29.2,14.2 R31.1
PIR_OUT
  Top 0.17: J5.3 9.3,9.7 9.3,9.8 9.3,11.2 15.4,17.3 16.35,17.3 R21.1
PIR_SUPPLY
  Top 0.5: C16.1 C18.1 R8.1 | C17.1 C16.1 | C16.1 C15.1 C13.1 20.6,6.85 19.1,6.85 | 19.1,6.85 16.45,6.85 C19.1 14.6,6.9 12.9,8.6 10.8,8.6 10.3,8.1 J5.2 | C14.1 19.1,6.85
SWDCLK
  Top 0.17: U1.P43 9.5,54.85 9.5,55.83 9.92,56.24 9.92,56.76 9.5,57.17 9.5,65.47 J1.4
SWDIO  (via drill 0.35)
  Top 0.17: 8.74,67.24 J1.2 8.73,67.23 8.79,67.17 8.79,66.64 9.82,65.61 9.82,58.98 v10.2,58.6 | U1.P44 8.5,54.83 9.18,55.51 9.18,55.96 9.3,56.09 v9.3,56.5
  Bottom 0.17: v9.3,56.5 9.3,57.7 v10.2,58.6
VBAT  (via drill 0.35)
  Top 0.17: 28.4,67.85 R14.2 31.3,69.25 v31.3,69.4
  Top 0.4: 30.35,80.75 30.6,81
  Top 0.5: U3.3 30.35,80.75 | J4.2 32.4,75.5 v31.6,76.3 | 28.4,67.85 Q3.2
  Bottom 0.17: v31.6,76.3 31.6,70.5 31.3,70.2 v31.3,69.4
  pour Top (no thermals): 33.9,75 33.9,76 32.7,76 31,77.7 31,84.7 32,85.7 34,85.7 34,86.8 31.4,86.8 30,85.4 30,77.2 32.2,75
VBAT_MEAS  (via drill 0.35)
  Top 0.17: R12.1 R11.2 20.75,66.25 v20,65.5 | U1.P15 15.65,42.15 v14.8,41.3
  Bottom 0.17: v20,65.5 20,64.41 11.1,55.51 11.1,48.57 10.5,47.97 10.5,43.5 11.9,42.1 14,42.1 v14.8,41.3
VBAT_SW
  Top 0.17: Q3.3 26,67.1 R12.2
VCC_3V3  (via drill 0.35)
  Top 0.17: J1.1 8.87,69.37 9.3,69.8 12.5,69.8 12.52,69.78 18.24,64.08 20.8,61.5 v27.4,61.5 | C1.1 19.5,46.6 19.4,46.7 U1.P17 | 25.8,56.15 R2.2 | R1.2 25.85,53.85 | 60.2,71.05 C11.1 59.8,71.1 | C12.1 59.8,73.55 v59.8,74.6 59.65,74.45 | U6.9 59.75,71.65 59.8,71.7 | R26.2 30.75,10.6 v30.1,10.6 | U6.2 56.44,71.65 v55.94,72.14
  Top 0.5: 24.51,46.71 25.8,48 25.8,53.8 25.85,53.85 R2.2 25.9,56.15 v25.9,57.5 | 19.45,46.7 C1.1 21.73,46.75 C2.1 24.51,46.71 | 59.8,71.1 59.8,71.7 v59.8,74.6 | 24.51,46.71 22.5,44.7 v22.5,37.3 22.6,37.3 22.45,37.45 | v19.4,16.4 19.7,16.7 20.4,16.7 | 20.4,16.7 U7.4 | C29.1 20.4,16.15 20.4,16.7 | R8.2 31.7,9 v30.1,10.6 | TP1.P$2 53.84,83.2 54.5,83.2 | 54.5,83.2 62.9,83.2 65.2,85.5 v65.9,85.5 | v59.8,77.9 54.5,83.2 | v69,86.6 69.06,86.66 69.06,87.7 | 69.06,87.7 C7.1 | U2.24 69.29,87.47 69.06,87.7
  Bottom 0.17: v27.4,61.5 28.09,61.5 28.84,60.74 | v59.8,74.6 59.42,74.22 59.42,73.14 58.41,72.14 v55.94,72.14
  Bottom 0.5: v25.9,57.5 25.9,57.8 28.84,60.74 31.95,60.74 49.72,78.51 TP1.P$2 | v59.8,77.9 v59.8,74.6 | v22.5,37.3 22.5,18.1 22.7,17.9 | 22.7,17.9 v30.1,10.6 | 22.7,17.9 20.9,17.9 v19.4,16.4 | v65.9,85.5 67.9,85.5 v69,86.6
  pour Top (no thermals): 43.5,86.7 45.1,86.7 45.1,86.5 50.5,86.5 50.5,88.1 50.1,88.5 47.6,88.5 46.9,87.8 45.1,87.8 45.1,87.2 43.5,87.2
  pour Top (no thermals): 58.6,72.3 58.6,71.5 59.8,71.5 59.8,72.3
VCC_3V3_EN  (via drill 0.35)
  Top 0.17: D4.3 35.4,92.6 | 35.4,92.6 D2.3 | TP8.P$2 35.6,92.6 35.4,92.6 | 41.45,85 R3.2
  Top 0.2: R3.2 41.5,83.45 v41.5,82 | U4.3 41.45,85
  Bottom 0.17: v41.5,82 41.5,86.7 TP8.P$2
VCC_LED  (via drill 0.35)
  Top 0.5: D7.1 75.6,73.9 v76.53,73.9 | v76.8,25.9 76.35,25.45 76.35,25.43 75.72,24.8 D8.1 | D6.1 28.3,72 40.2,72 45.23,77.03 60.8,77.1 67.2,83.5 v67.2,88.5 67.2,89.5 TP10.P$2 | v72.35,75.55 71.66,75.55 24.99,28.88 24.99,27.81 26,26.8 26.92,26.8 27.15,26.57 27.15,25.43 26.52,24.8 D1.1
  Bottom 0.5: v72.35,75.55 74,73.9 v76.53,73.9 | v76.53,73.9 76.53,26.18 v76.8,25.9 | v67.2,88.5 68.6,88.5 76.53,80.58 v76.53,73.9
  pour Top (no thermals): 57.4,89.2 59.3,89.2 59.8,89.7 59.8,91.1 60.1,91.4 64,91.4 65.3,90.1 66.5,90.1 66.5,91.7 65.8,92.4 59.1,92.4 58.8,92.1 58.8,90 58.5,89.7 57.4,89.7
VDC
  Top 0.17: D5.2 15.8,92 17.26,93.46 R5.2
  Top 0.5: U3.4 25.45,80.75 24.8,81.4
  pour Top (no thermals): 10.1,87.9 12.3,87.9 13.5,86.7 13.5,82.5 15.4,80.6 24.5,80.6 31.4,87.5 33.9,87.5 34,87.6 34,88.7 30.7,88.7 24.1,82.1 16,82.1 15,83.1 15,87.2 12.6,89.5 12.6,90.5 12.9,90.8 12.9,92.7 9.9,92.7 9.9,90.7 10.1,90.5
VDC_ATTACHED  (via drill 0.35)
  Top 0.17: D4.1 R4.2 26.16,95.14 R5.1 26.1,95.2 v24.4,95.2 | v13.06,47.76 14,46.81 U1.P12
  Bottom 0.17: v13.06,47.76 13.06,56.56 21.6,65.1 21.6,85.5 24.4,88.3 v24.4,95.2
VSYS
  Top 0.3: C4.1 39.85,86.9
  pour Top (no thermals): 41.7,87 41.1,87 40.4,87.8 39.3,87.8 39.3,88.9 39,89.2 38.3,89.3 36.6,87.7 34.7,87.7 34.7,86.7 36.6,86.7 36.8,86.5 40.4,86.5 41.1,86.9 41.7,86.9
  pour Top (no thermals): 38.2,89.3 43.3,94.4 51.4,94.4 57,88.8 58.9,88.8 58.9,85.4 57.9,85.4 57.9,86.3 56,86.3 55.4,86.9 55.4,88.8 51,93.3 43.7,93.3 39.2,88.8 38.7,89.3

### Text on the board
Top: Circuit Dojo / PCB-0002-01